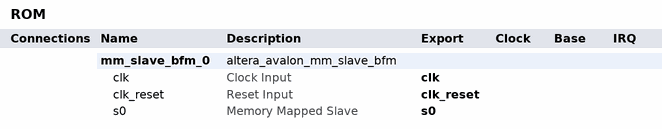
[diagram p0: system contents]
# Platform Designer (Qsys) system ROM, Cyclone V 5CGXFC7C7F23C8
# Parameters at their usual value, and those the tool derives, are not listed.
package require -exact qsys 18.1
create_system ROM
set_project_property DEVICE_FAMILY {Cyclone V}
set_project_property DEVICE 5CGXFC7C7F23C8

add_instance mm_slave_bfm_0 altera_avalon_mm_slave_bfm 18.1
set_instance_property mm_slave_bfm_0 AUTO_EXPORT true
set_instance_parameter_value mm_slave_bfm_0 ADDRESS_UNITS WORDS
set_instance_parameter_value mm_slave_bfm_0 ASSERT_HIGH_ARBITERLOCK 1
set_instance_parameter_value mm_slave_bfm_0 ASSERT_HIGH_BYTEENABLE 1
set_instance_parameter_value mm_slave_bfm_0 ASSERT_HIGH_LOCK 1
set_instance_parameter_value mm_slave_bfm_0 ASSERT_HIGH_READ 1
set_instance_parameter_value mm_slave_bfm_0 ASSERT_HIGH_READDATAVALID 1
set_instance_parameter_value mm_slave_bfm_0 ASSERT_HIGH_RESET 1
set_instance_parameter_value mm_slave_bfm_0 ASSERT_HIGH_WAITREQUEST 1
set_instance_parameter_value mm_slave_bfm_0 ASSERT_HIGH_WRITE 1
set_instance_parameter_value mm_slave_bfm_0 AV_ADDRESS_W 16
set_instance_parameter_value mm_slave_bfm_0 AV_BURSTCOUNT_W 3
set_instance_parameter_value mm_slave_bfm_0 AV_BURST_BNDR_ONLY 1
set_instance_parameter_value mm_slave_bfm_0 AV_BURST_LINEWRAP 1
set_instance_parameter_value mm_slave_bfm_0 AV_FIX_READ_LATENCY 0
set_instance_parameter_value mm_slave_bfm_0 AV_MAX_PENDING_READS 1
set_instance_parameter_value mm_slave_bfm_0 AV_MAX_PENDING_WRITES 0
set_instance_parameter_value mm_slave_bfm_0 AV_NUMSYMBOLS 4
set_instance_parameter_value mm_slave_bfm_0 AV_READRESPONSE_W 8
set_instance_parameter_value mm_slave_bfm_0 AV_READ_WAIT_TIME 1
set_instance_parameter_value mm_slave_bfm_0 AV_REGISTERINCOMINGSIGNALS 0
set_instance_parameter_value mm_slave_bfm_0 AV_SYMBOL_W 8
set_instance_parameter_value mm_slave_bfm_0 AV_WRITERESPONSE_W 8
set_instance_parameter_value mm_slave_bfm_0 AV_WRITE_WAIT_TIME 0
set_instance_parameter_value mm_slave_bfm_0 REGISTER_WAITREQUEST 0
set_instance_parameter_value mm_slave_bfm_0 USE_ADDRESS 1
set_instance_parameter_value mm_slave_bfm_0 USE_ARBITERLOCK 0
set_instance_parameter_value mm_slave_bfm_0 USE_BEGIN_BURST_TRANSFER 0
set_instance_parameter_value mm_slave_bfm_0 USE_BEGIN_TRANSFER 0
set_instance_parameter_value mm_slave_bfm_0 USE_BURSTCOUNT 1
set_instance_parameter_value mm_slave_bfm_0 USE_BYTE_ENABLE 1
set_instance_parameter_value mm_slave_bfm_0 USE_CLKEN 0
set_instance_parameter_value mm_slave_bfm_0 USE_DEBUGACCESS 0
set_instance_parameter_value mm_slave_bfm_0 USE_LOCK 0
set_instance_parameter_value mm_slave_bfm_0 USE_READ 1
set_instance_parameter_value mm_slave_bfm_0 USE_READRESPONSE 0
set_instance_parameter_value mm_slave_bfm_0 USE_READ_DATA 1
set_instance_parameter_value mm_slave_bfm_0 USE_READ_DATA_VALID 1
set_instance_parameter_value mm_slave_bfm_0 USE_TRANSACTIONID 0
set_instance_parameter_value mm_slave_bfm_0 USE_WAIT_REQUEST 1
set_instance_parameter_value mm_slave_bfm_0 USE_WRITE 1
set_instance_parameter_value mm_slave_bfm_0 USE_WRITERESPONSE 0
set_instance_parameter_value mm_slave_bfm_0 USE_WRITE_DATA 1
set_instance_parameter_value mm_slave_bfm_0 VHDL_ID 0

# exported interfaces
add_interface clk clock sink
set_interface_property clk EXPORT_OF mm_slave_bfm_0.clk
add_interface clk_reset reset sink
set_interface_property clk_reset EXPORT_OF mm_slave_bfm_0.clk_reset
add_interface s0 avalon slave
set_interface_property s0 EXPORT_OF mm_slave_bfm_0.s0

set_interconnect_requirement {$system} qsys_mm.clockCrossingAdapter HANDSHAKE
set_interconnect_requirement {$system} qsys_mm.enableEccProtection FALSE
set_interconnect_requirement {$system} qsys_mm.insertDefaultSlave FALSE
set_interconnect_requirement {$system} qsys_mm.maxAdditionalLatency 1

save_system ROM.qsys
